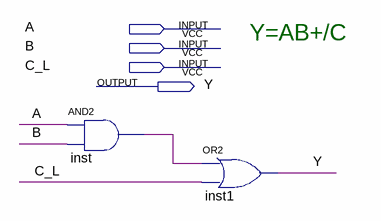
[diagram p0: schematic sheet]
// Quartus schematic f15_per7.bdf as structural Verilog: 2 symbols, 4 pins
module f15_per7 (
  input  A,
  input  B,
  input  C_L,
  output Y
);

  wire inst_out;

  and inst (inst_out, A, B);
  or inst1 (Y, inst_out, C_L);

  // Notes on the sheet:
  //   Y=AB+/C
endmodule
